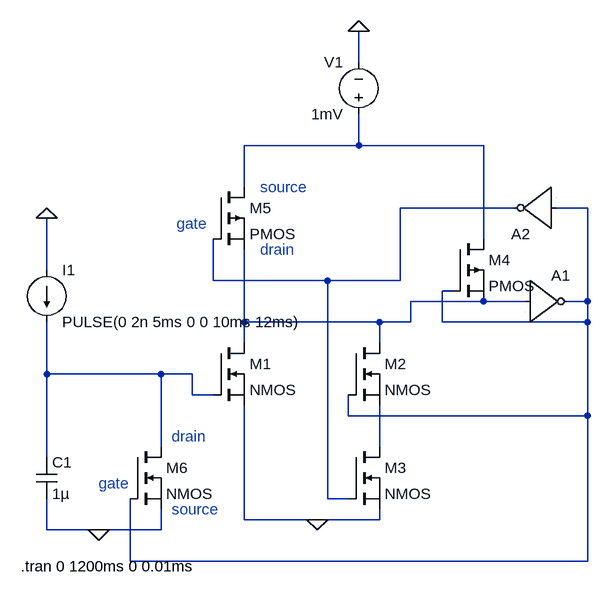
[diagram p0: schematic NueroBuildUp.asc]
NueroBuildUp.asc, the LTspice schematic file:
Version 4
SHEET 1 952 680
WIRE 592 -448 592 -496
WIRE 592 -320 592 -368
WIRE 592 -320 416 -320
WIRE 784 -320 592 -320
WIRE 416 -256 416 -320
WIRE 832 -224 656 -224
WIRE 944 -224 896 -224
WIRE 784 -176 784 -320
WIRE 112 -128 112 -208
WIRE 368 -112 368 -176
WIRE 544 -112 368 -112
WIRE 656 -112 656 -224
WIRE 656 -112 544 -112
WIRE 736 -96 720 -96
WIRE 784 -80 672 -80
WIRE 848 -80 784 -80
WIRE 944 -80 944 -224
WIRE 944 -80 912 -80
WIRE 416 -48 416 -160
WIRE 624 -48 416 -48
WIRE 672 -48 672 -80
WIRE 672 -48 624 -48
WIRE 720 -48 720 -96
WIRE 944 -48 944 -80
WIRE 944 -48 720 -48
WIRE 416 -16 416 -48
WIRE 624 -16 624 -48
WIRE 112 32 112 -48
WIRE 288 32 112 32
WIRE 336 32 288 32
WIRE 336 64 336 32
WIRE 368 64 336 64
WIRE 576 96 576 64
WIRE 944 96 944 -48
WIRE 944 96 576 96
WIRE 288 144 288 32
WIRE 624 144 624 80
WIRE 112 160 112 32
WIRE 544 224 544 -112
WIRE 576 224 544 224
WIRE 416 256 416 80
WIRE 528 256 416 256
WIRE 624 256 624 240
WIRE 624 256 528 256
WIRE 112 272 112 224
WIRE 192 272 112 272
WIRE 288 272 288 240
WIRE 288 272 192 272
WIRE 240 320 240 224
WIRE 944 320 944 96
WIRE 944 320 240 320
FLAG 112 -208 0
FLAG 592 -496 0
FLAG 192 272 0
FLAG 528 256 0
SYMBOL cap 96 160 R0
SYMATTR InstName C1
SYMATTR Value 1µ
SYMBOL nmos 240 144 R0
SYMATTR InstName M6
SYMBOL current 112 -128 R0
WINDOW 123 0 0 Left 0
WINDOW 39 0 0 Left 0
SYMATTR InstName I1
SYMATTR Value PULSE(0 2n 5ms 0 0 10ms 12ms)
SYMBOL nmos 368 -16 R0
SYMATTR InstName M1
SYMBOL nmos 576 -16 R0
SYMATTR InstName M2
SYMBOL nmos 576 144 R0
SYMATTR InstName M3
SYMBOL pmos 368 -256 R0
SYMATTR InstName M5
SYMBOL pmos 736 -176 R0
SYMATTR InstName M4
SYMBOL Digital\\inv 848 -144 R0
SYMATTR InstName A1
SYMBOL Digital\\inv 896 -160 R180
SYMATTR InstName A2
SYMBOL voltage 592 -352 R180
WINDOW 0 24 96 Left 2
WINDOW 3 24 16 Left 2
WINDOW 123 0 0 Left 0
WINDOW 39 0 0 Left 0
SYMATTR InstName V1
SYMATTR Value 1mV
TEXT 304 240 Left 2 ;source
TEXT 192 200 Left 2 ;gate
TEXT 304 128 Left 2 ;drain
TEXT 440 -256 Left 2 ;source
TEXT 440 -160 Left 2 ;drain
TEXT 312 -200 Left 2 ;gate
TEXT 72 328 Left 2 !.tran 0 1200ms 0 0.01ms

The netlist it stands for:
* NueroBuildUp.asc
C1 N005 0 1µ
M6 N005 N003 0 0 NMOS
I1 0 N005 PULSE(0 2n 5ms 0 0 10ms 12ms)
M1 N004 N005 0 0 NMOS
M2 N004 N003 N006 N006 NMOS
M3 N006 N002 0 0 NMOS
M5 N001 N002 N004 N004 PMOS
M4 N001 N003 N004 N004 PMOS
A1 N004 0 0 0 0 N003 0 0 BUF
A2 N003 0 0 0 0 N002 0 0 BUF
V1 N001 0 1mV
.model NMOS NMOS
.model PMOS PMOS
.lib standard.mos
* source
* gate
* drain
* source
* drain
* gate
.tran 0 1200ms 0 0.01ms
.backanno
.end